# EAGLE design 8j-merge (EAGLE 6.6.0)
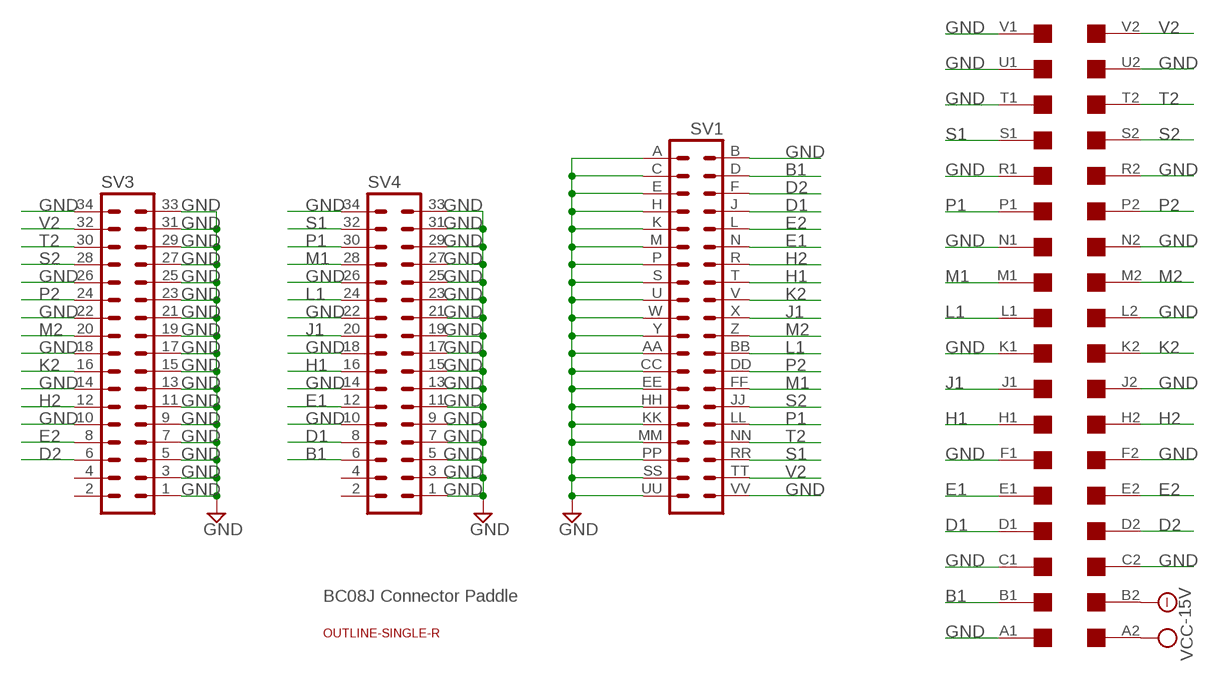
[diagram p0: schematic, sheet 1]

## Parts
SV1  DEC40PINV  [DEC40PINV]
SV3  MA17-2  [MA17-2]
SV4  MA17-2  [MA17-2]
U$1  OUTLINE-SINGLE-R  [SINGLE-R]
U$2  SINGLE  [EDGE-CON2]

## Nets
-15V: U$2.B2
B1: SV1.D SV4.6 U$2.B1
D1: SV1.J SV4.8 U$2.D1
D2: SV1.F SV3.6 U$2.D2
E1: SV1.N SV4.12 U$2.E1
E2: SV1.L SV3.8 U$2.E2
GND: SV1.A SV1.AA SV1.B SV1.C SV1.CC SV1.E SV1.EE SV1.H SV1.HH SV1.K SV1.KK SV1.M SV1.MM SV1.P SV1.PP SV1.S SV1.SS SV1.U SV1.UU SV1.VV SV1.W SV1.Y SV3.1 SV3.3 SV3.5 SV3.7 SV3.9 SV3.10 SV3.11 SV3.13 SV3.14 SV3.15 SV3.17 SV3.18 SV3.19 SV3.21 SV3.22 SV3.23 SV3.25 SV3.26 SV3.27 SV3.29 SV3.31 SV3.33 SV3.34 SV4.1 SV4.3 SV4.5 SV4.7 SV4.9 SV4.10 SV4.11 SV4.13 SV4.14 SV4.15 SV4.17 SV4.18 SV4.19 SV4.21 SV4.22 SV4.23 SV4.25 SV4.26 SV4.27 SV4.29 SV4.31 SV4.33 SV4.34 U$2.A1 U$2.C1 U$2.C2 U$2.F1 U$2.F2 U$2.J2 U$2.K1 U$2.L2 U$2.N1 U$2.N2 U$2.R1 U$2.R2 U$2.T1 U$2.U1 U$2.U2 U$2.V1
H1: SV1.T SV4.16 U$2.H1
H2: SV1.R SV3.12 U$2.H2
J1: SV1.X SV4.20 U$2.J1
K2: SV1.V SV3.16 U$2.K2
L1: SV1.BB SV4.24 U$2.L1
M1: SV1.FF SV4.28 U$2.M1
M2: SV1.Z SV3.20 U$2.M2
P1: SV1.LL SV4.30 U$2.P1
P2: SV1.DD SV3.24 U$2.P2
S1: SV1.RR SV4.32 U$2.S1
S2: SV1.JJ SV3.28 U$2.S2
T2: SV1.NN SV3.30 U$2.T2
V2: SV1.TT SV3.32 U$2.V2
VCC: U$2.A2
Unconnected: SV3.2 SV3.4 SV4.2 SV4.4

## Notes on the sheet
- BC08J Connector Paddle

## Library data of the parts
SV1 = dec-con:DEC40PIN: PIN HEADER
SV3 SV4 = con-lstb:MA17-2: PIN HEADER; OC_FARNELL: unknown; OC_NEWARK: unknown
U$1 = dec-con:OUTLINE-*: Board outlines for DEC boards.
U$2 = dec-con:SINGLE: Single-Height DEC board

## Board
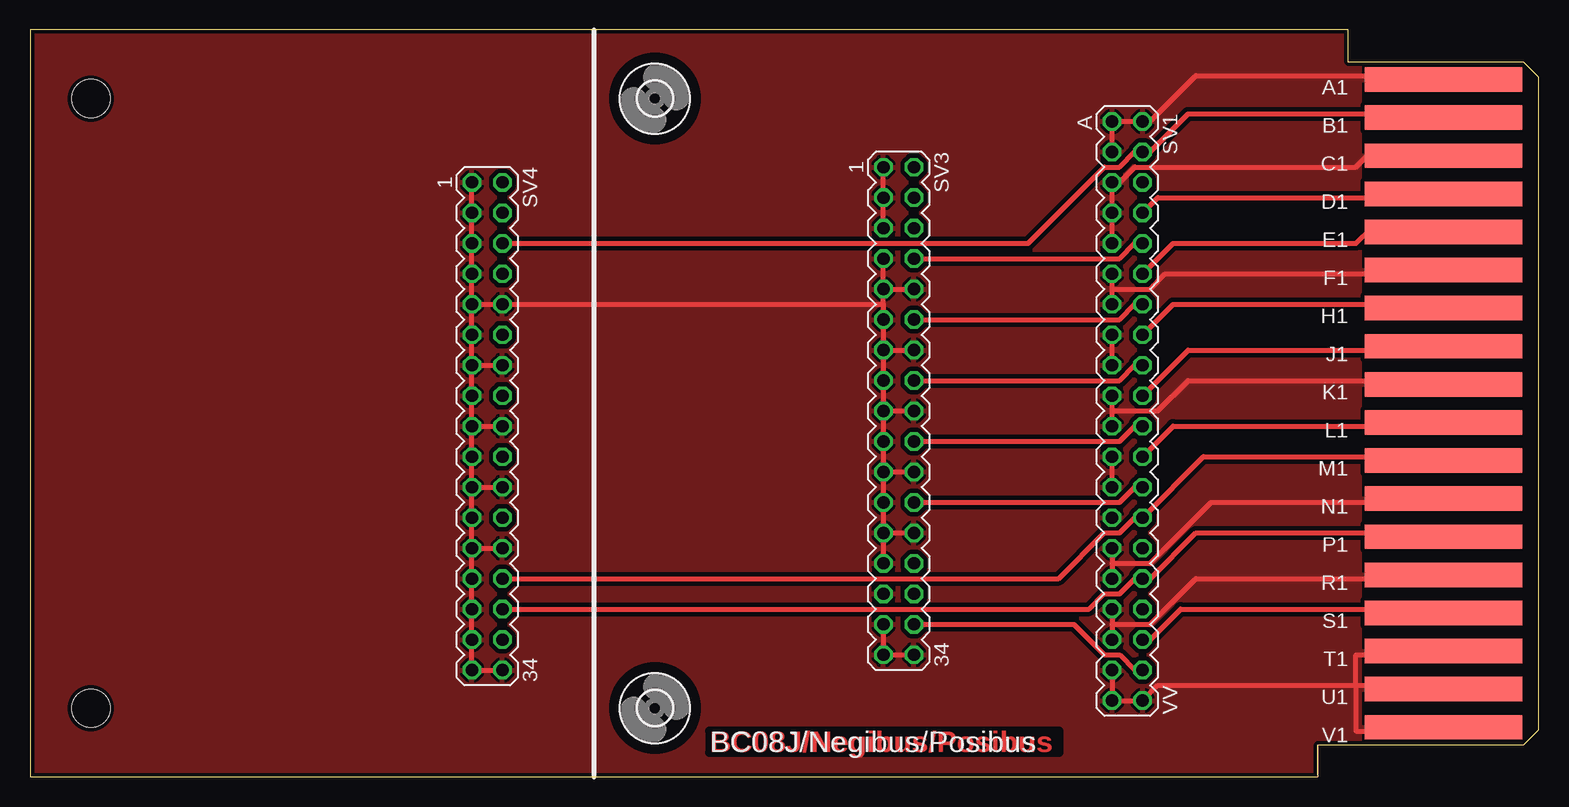
[diagram p1: board, top side]
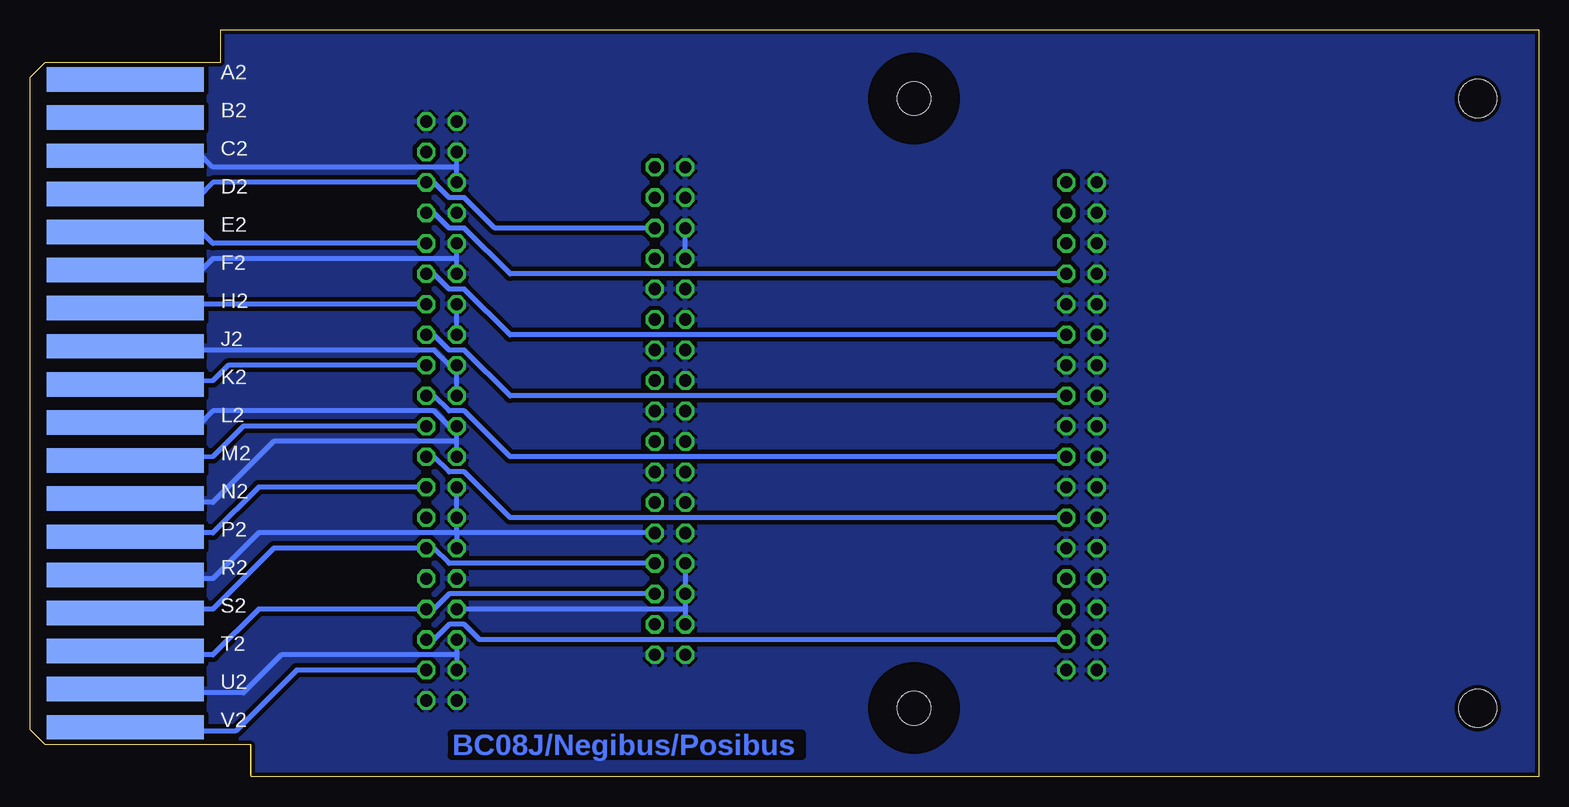
[diagram p2: board, bottom side, seen from below]

Size 125.73 x 62.23 mm. Coordinates in mm from the lower left corner, seen from the top.
Copper layers (1+16): Top 0.035mm / dielectric 1.5mm / Bottom 0.035mm
Design rules "16mils": minimum track width 16mil, minimum drill 32mil, track to track 15mil, track to pad 10mil, pad to pad 10mil, via to via 10mil, smd to smd 10mil, copper to edge 13mil, drill to drill 10mil, minimum pad ring 10mil, minimum via ring 8mil, stop-mask expansion 0mil, vias tented up to drill 0mil, thermal gap 10mil

### Footprints (pad centres in the part's own frame; a part is rotated, then mirrored left to right if it is on the bottom)
DEC40PINV = drill 1.016 octagon: A -24.13,-1.27; AA 3.81,-1.27; B -24.13,1.27; BB 3.81,1.27; C -21.59,-1.27; CC 6.35,-1.27; D -21.59,1.27; DD 6.35,1.27; E -19.05,-1.27; EE 8.89,-1.27; F -19.05,1.27; FF 8.89,1.27; H -16.51,-1.27; HH 11.43,-1.27; J -16.51,1.27; JJ 11.43,1.27; K -13.97,-1.27; KK 13.97,-1.27; L -13.97,1.27; LL 13.97,1.27; M -11.43,-1.27; MM 16.51,-1.27; N -11.43,1.27; NN 16.51,1.27; P -8.89,-1.27; PP 19.05,-1.27; R -8.89,1.27; RR 19.05,1.27; S -6.35,-1.27; SS 21.59,-1.27; T -6.35,1.27; TT 21.59,1.27; U -3.81,-1.27; UU 24.13,-1.27; V -3.81,1.27; VV 24.13,1.27; W -1.27,-1.27; X -1.27,1.27; Y 1.27,-1.27; Z 1.27,1.27
MA17-2 = drill 1.016 octagon: 1 -20.32,-1.27; 2 -20.32,1.27; 3 -17.78,-1.27; 4 -17.78,1.27; 5 -15.24,-1.27; 6 -15.24,1.27; 7 -12.7,-1.27; 8 -12.7,1.27; 9 -10.16,-1.27; 10 -10.16,1.27; 11 -7.62,-1.27; 12 -7.62,1.27; 13 -5.08,-1.27; 14 -5.08,1.27; 15 -2.54,-1.27; 16 -2.54,1.27; 17 0,-1.27; 18 0,1.27; 19 2.54,-1.27; 20 2.54,1.27; 21 5.08,-1.27; 22 5.08,1.27; 23 7.62,-1.27; 24 7.62,1.27; 25 10.16,-1.27; 26 10.16,1.27; 27 12.7,-1.27; 28 12.7,1.27; 29 15.24,-1.27; 30 15.24,1.27; 31 17.78,-1.27; 32 17.78,1.27; 33 20.32,-1.27; 34 20.32,1.27
SINGLE-R = hole 3.175: 5.08,5.715; 5.08,56.515
EDGE-CON2 = smd 13.106 x 2.032: A1 7.938,4.128; B1 7.938,7.303; C1 7.938,10.477; D1 7.938,13.652; E1 7.938,16.828; F1 7.938,20.003; H1 7.938,23.177; J1 7.938,26.352; K1 7.938,29.527; L1 7.938,32.703; M1 7.938,35.877; N1 7.938,39.053; P1 7.938,42.227; R1 7.938,45.403; S1 7.938,48.578; T1 7.938,51.752; U1 7.938,54.928; V1 7.938,58.102 | smd 13.106 x 2.032 bottom: A2 7.938,4.128; B2 7.938,7.303; C2 7.938,10.477; D2 7.938,13.652; E2 7.938,16.828; F2 7.938,20.003; H2 7.938,23.177; J2 7.938,26.352; K2 7.938,29.527; L2 7.938,32.703; M2 7.938,35.877; N2 7.938,39.053; P2 7.938,42.227; R2 7.938,45.403; S2 7.938,48.578; T2 7.938,51.752; U2 7.938,54.928; V2 7.938,58.102
2,8 = hole 2.8: 0,0

### Placement (x,y rotation side)
SV1  91.44,30.48 270 top
SV3  72.39,30.48 270 top
SV4  38.1,29.21 270 top
U$1  0,0 0 top
U$2  125.73,62.23 180 top
U$3  [2,8]  52.07,56.52 0 top
U$4  [2,8]  52.07,5.71 0 top

### Tracks (layer width: path | path; a pad name or v marks a point on that pad's centre or on a via)
B1
  Top 0.406: SV4.6 83.19,44.45 89.53,50.8 90.81,50.8 92.08,52.07 SV1.D 93.34,52.07 96.52,55.24 113.03,55.24 U$2.B1
D1
  Top 0.406: U$2.D1 111.76,48.26 93.98,48.26 SV1.J
  Bottom 0.406: SV4.8 85.72,41.91 89.53,45.72 90.81,45.72 92.08,46.99 SV1.J
D2
  Bottom 0.406: SV3.6 87,45.72 89.53,48.26 90.81,48.26 92.08,49.53 SV1.F 110.49,49.53 111.76,48.26 U$2.D2
E1
  Top 0.406: SV1.N 95.25,44.45 110.49,44.45 111.76,45.72 U$2.E1
  Bottom 0.406: SV4.12 85.72,36.83 89.53,40.64 90.81,40.64 92.08,41.91 SV1.N
E2
  Top 0.406: SV3.8 90.81,43.18 92.08,44.45 SV1.L
  Bottom 0.406: SV1.L 110.49,44.45 111.76,45.72 U$2.E2
GND
  Top 0.406: 90.17,17.78 SV1.KK | SV1.HH 90.17,17.78 | SV1.CC SV1.AA | 90.17,30.48 SV1.W | SV1.Y 90.17,30.48 | SV1.U SV1.S | 90.17,40.64 SV1.M | SV1.P 90.17,40.64 | SV1.K SV1.H SV1.E 90.81,49.53 92.08,50.8 110.49,50.8 111.76,52.07 U$2.C1 | SV1.C SV1.A SV1.B 93.34,54.61 97.16,58.42 113.03,58.42 U$2.A1 | 90.17,17.78 93.34,17.78 98.42,22.86 111.76,22.86 U$2.N1 | 90.17,30.48 93.98,30.48 96.52,33.02 113.03,33.02 U$2.K1 | 90.17,40.64 93.34,40.64 94.61,41.91 111.76,41.91 U$2.F1 | SV4.34 SV4.33 SV4.31 SV4.29 SV4.27 SV4.25 | SV4.25 SV4.26 | SV4.25 SV4.23 SV4.21 | SV4.21 SV4.22 | SV4.21 SV4.19 SV4.17 | SV4.17 SV4.18 | SV4.17 SV4.15 SV4.13 | SV4.13 SV4.14 | SV4.13 SV4.11 SV4.9 | SV4.9 SV4.10 71.12,39.37 | SV4.9 SV4.7 SV4.5 SV4.3 SV4.1 | 110.49,7.62 110.49,3.81 111.76,3.81 U$2.V1 | 110.49,7.62 110.49,10.16 111.76,10.16 U$2.T1 | 110.49,7.62 U$2.U1 111.76,7.62 110.49,7.62 | SV1.SS SV1.UU SV1.VV 93.98,7.62 110.49,7.62 | SV1.MM 90.17,12.7 | 90.17,12.7 SV1.PP | SV3.34 SV3.33 SV3.31 | SV3.25 SV3.27 | SV3.25 SV3.23 SV3.21 | SV3.25 SV3.26 | SV3.21 SV3.22 | SV3.21 SV3.19 SV3.17 | SV3.17 SV3.15 SV3.13 | SV3.17 SV3.18 | SV3.13 SV3.14 | SV3.13 SV3.11 71.12,39.37 | 71.12,39.37 SV3.9 | SV3.9 SV3.10 | SV3.9 SV3.7 | SV3.5 SV3.3 SV3.1 | 90.17,12.7 93.34,12.7 97.16,16.51 112.39,16.51 U$2.R1
  Bottom 0.406: 90.17,20.32 SV1.EE SV1.CC | 90.17,20.32 SV1.HH | 90.17,27.94 SV1.Y 90.81,29.21 92.08,30.48 110.49,30.48 111.76,29.21 U$2.L2 | SV1.AA 90.17,27.94 | SV1.W SV1.U 90.81,34.29 92.08,35.56 111.76,35.56 U$2.J2 | SV1.S SV1.P | 90.17,43.18 SV1.K | SV1.M 90.17,43.18 | 90.17,50.8 SV1.C | SV1.E 90.17,50.8 | 90.17,20.32 106.68,20.32 110.49,16.51 113.03,16.51 U$2.R1 | 90.17,27.94 105.41,27.94 110.49,22.86 113.03,22.86 U$2.N1 | 90.17,43.18 110.49,43.18 111.76,41.91 U$2.F1 | 90.17,50.8 110.49,50.8 111.76,52.07 U$2.C1 | SV1.PP 90.17,10.16 | 90.17,10.16 SV1.SS | 71.12,13.97 SV3.29 SV3.27 | 71.12,13.97 SV3.31 | SV3.7 SV3.5 | 71.12,13.97 SV1.MM | SV3.26 90.17,20.32 | 90.17,10.16 104.78,10.16 107.95,6.99 113.03,6.99 U$2.U1
  pour Bottom (isolate 0.254): 0,62.23 111.76,62.23 111.76,0 0,0
  pour Top (isolate 0.254): 111.76,62.23 0,62.23 0,0 111.76,0
H1
  Top 0.406: SV1.T 95.25,39.37 111.76,39.37 U$2.H1
  Bottom 0.406: SV4.16 85.72,31.75 89.53,35.56 90.81,35.56 92.08,36.83 SV1.T
H2
  Top 0.406: SV3.12 74.3,38.1 90.81,38.1 92.08,39.37 SV1.R
  Bottom 0.406: SV1.R 93.34,39.37 111.76,39.37 U$2.H2
J1
  Top 0.406: SV1.X 96.52,35.56 113.03,35.56 U$2.J1
  Bottom 0.406: SV4.20 85.72,26.67 89.53,30.48 90.81,30.48 92.08,31.75 SV1.X
K2
  Top 0.406: SV3.16 90.81,33.02 92.08,34.29 SV1.V
  Bottom 0.406: SV1.V 109.22,34.29 110.49,33.02 U$2.K2
L1
  Top 0.406: SV1.BB 95.25,29.21 112.39,29.21 U$2.L1
  Bottom 0.406: SV4.24 85.72,21.59 89.53,25.4 90.81,25.4 92.08,26.67 SV1.BB
M1
  Top 0.406: SV4.28 85.72,16.51 89.53,20.32 90.81,20.32 92.08,21.59 SV1.FF 97.79,26.67 113.03,26.67 U$2.M1
M2
  Top 0.406: SV3.20 90.81,27.94 92.08,29.21 SV1.Z
  Bottom 0.406: SV1.Z 107.95,29.21 110.49,26.67 U$2.M2
P1
  Top 0.406: SV4.30 88.27,13.97 89.53,15.24 90.81,15.24 92.08,16.51 SV1.LL 93.34,16.51 97.16,20.32 112.39,20.32 U$2.P1
P2
  Top 0.406: SV3.24 90.81,22.86 92.08,24.13 SV1.DD
  Bottom 0.406: SV1.DD 106.68,24.13 110.49,20.32 111.76,20.32 U$2.P2
S1
  Top 0.406: U$2.S1 113.03,13.97 95.89,13.97 93.34,11.43 SV1.RR
  Bottom 0.406: SV4.32 88.27,11.43 89.53,12.7 90.81,12.7 92.08,11.43 SV1.RR
S2
  Bottom 0.406: SV3.28 90.81,17.78 92.08,19.05 SV1.JJ 105.41,19.05 110.49,13.97 111.76,13.97 U$2.S2
T2
  Bottom 0.406: SV3.30 90.81,15.24 92.08,13.97 SV1.NN 106.68,13.97 110.49,10.16 111.76,10.16 U$2.T2
V2
  Top 0.406: SV3.32 87,12.7 89.53,10.16 90.81,10.16 92.08,8.89 SV1.TT
  Bottom 0.406: SV1.TT 103.5,8.89 108.58,3.81 113.03,3.81 U$2.V2

### Text on the board
Top: BC08J/Negibus/Posibus
Bottom: BC08J/Negibus/Posibus
tPlace: BC08J/Negibus/Posibus
tValues: * | * | * | * | * | * | * | * | * | * | * | * | Side 1 | Side 2 | * | * | * | * | * | * | * | BC08J | * | * | * | * | * | * | * | * | * | * | * | * | * | * | * | * | *